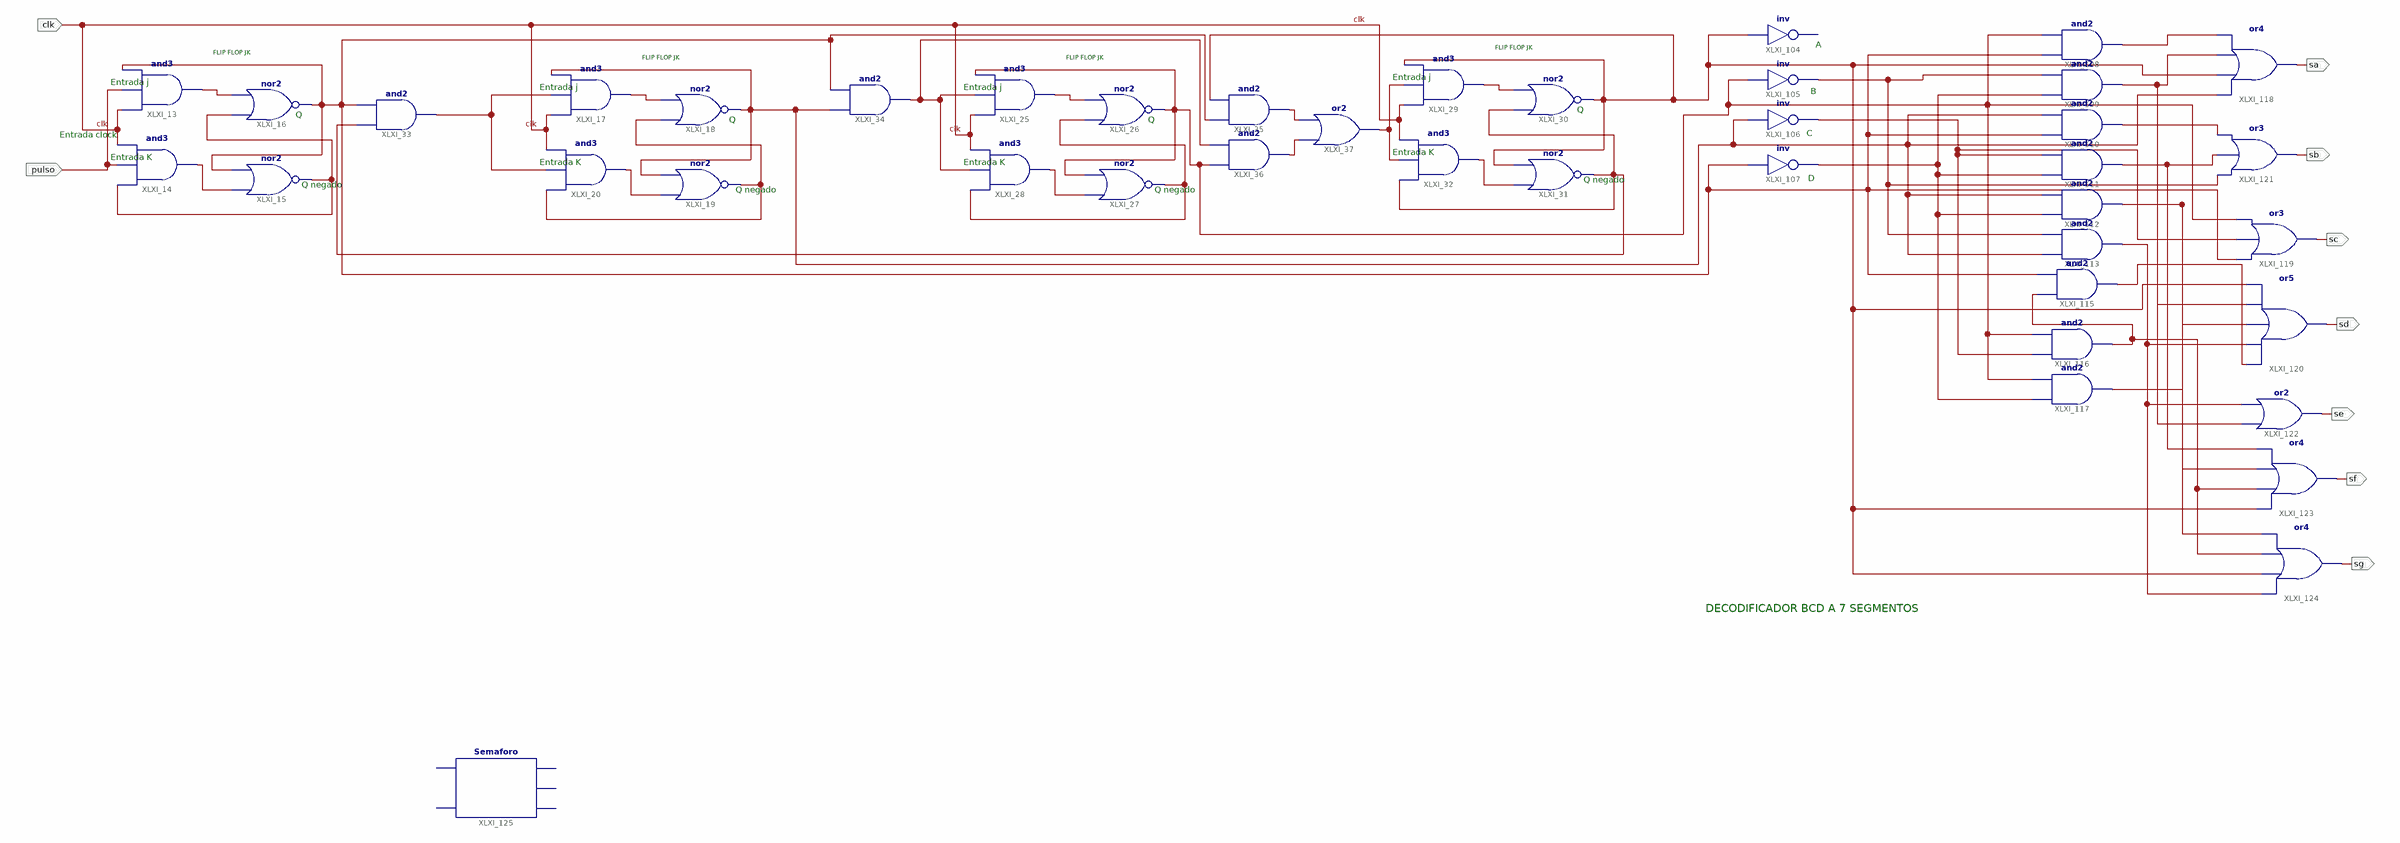
[diagram p0: schematic sheet 1]
// Xilinx ISE schematic parcialfinal.sch (spartan3e) as structural Verilog: 42 symbols, 9 ports
module parcialfinal (
  input  pulso,
  input  clk,
  output sa,
  output sb,
  output sc,
  output sd,
  output se,
  output sf,
  output sg
);

  wire Aout, b_cnegado, b_cnegado_d, bd, bnegado, bnegado_c, bnegado_dnegado, Bout, c_dnegado, cd, cnegado,
       cnegado_denegado, Cout, dnegado, dnegado_b, Dout, Qnegado, XLXN_9, XLXN_10, XLXN_25, XLXN_26, XLXN_30,
       XLXN_39, XLXN_40, XLXN_44, XLXN_45, XLXN_46, XLXN_50, XLXN_53, XLXN_128, XLXN_131, XLXN_136, XLXN_156;

  and XLXI_13 (XLXN_9, clk, pulso, Dout);
  and XLXI_14 (XLXN_10, Qnegado, pulso, clk);
  nor XLXI_15 (Qnegado, XLXN_10, Dout);
  nor XLXI_16 (Dout, Qnegado, XLXN_9);
  and XLXI_33 (XLXN_128, XLXN_50, Dout);
  and XLXI_25 (XLXN_39, clk, XLXN_131, Bout);
  nor XLXI_26 (Bout, XLXN_44, XLXN_39);
  nor XLXI_27 (XLXN_44, XLXN_40, Bout);
  and XLXI_28 (XLXN_40, XLXN_44, XLXN_131, clk);
  and XLXI_17 (XLXN_25, clk, XLXN_128, Cout);
  nor XLXI_18 (Cout, XLXN_30, XLXN_25);
  nor XLXI_19 (XLXN_30, XLXN_26, Cout);
  and XLXI_20 (XLXN_26, XLXN_30, XLXN_128, clk);
  and XLXI_34 (XLXN_131, Cout, Dout);
  and XLXI_32 (XLXN_46, XLXN_50, XLXN_156, clk);
  nor XLXI_31 (XLXN_50, XLXN_46, Aout);
  nor XLXI_30 (Aout, XLXN_50, XLXN_45);
  and XLXI_29 (XLXN_45, clk, XLXN_156, Aout);
  and XLXI_35 (XLXN_53, Dout, Aout);
  and XLXI_36 (XLXN_136, Bout, XLXN_131);
  or XLXI_37 (XLXN_156, XLXN_136, XLXN_53);
  // inv XLXI_104 has open pins: I=Aout, O=open
  not XLXI_105 (bnegado, Bout);
  not XLXI_106 (cnegado, Cout);
  not XLXI_107 (dnegado, Dout);
  and XLXI_108 (bd, Dout, Bout);
  and XLXI_109 (bnegado_dnegado, dnegado, bnegado);
  and XLXI_111 (cnegado_denegado, dnegado, cnegado);
  and XLXI_112 (c_dnegado, dnegado, Cout);
  and XLXI_113 (bnegado_c, Cout, bnegado);
  and XLXI_115 (b_cnegado_d, b_cnegado, Dout);
  and XLXI_116 (b_cnegado, cnegado, Bout);
  and XLXI_117 (dnegado_b, dnegado, Bout);
  or XLXI_118 (sa, Cout, Aout, bnegado_dnegado, bd);
  or XLXI_119 (sc, Dout, cnegado, Bout);
  or XLXI_120 (sd, b_cnegado_d, bnegado_c, c_dnegado, bnegado_dnegado, Aout);
  or XLXI_121 (sb, bnegado, cnegado_denegado, cd);
  or XLXI_122 (se, bnegado_dnegado, bnegado_c);
  or XLXI_123 (sf, Aout, b_cnegado, dnegado_b, cnegado_denegado);
  or XLXI_124 (sg, bnegado_c, Aout, b_cnegado, c_dnegado);
  and XLXI_110 (cd, Dout, Cout);
  Semaforo XLXI_125 ();  // open: clk, reset, rojo, amarillo, verde

  // Notes on the sheet:
  //   A
  //   FLIP FLOP JK
  //   FLIP FLOP JK
  //   FLIP FLOP JK
  //   FLIP FLOP JK
  //   Entrada j
  //   Entrada j
  //   Entrada j
  //   Entrada j
  //   B
  //   Q
  //   Q
  //   Q
  //   Q
  //   C
  //   Entrada clock
  //   Entrada K
  //   Entrada K
  //   Entrada K
  //   Entrada K
  //   D
  //   Q negado
  //   Q negado
  //   Q negado
  //   Q negado
  //   DECODIFICADOR BCD A 7 SEGMENTOS
endmodule
